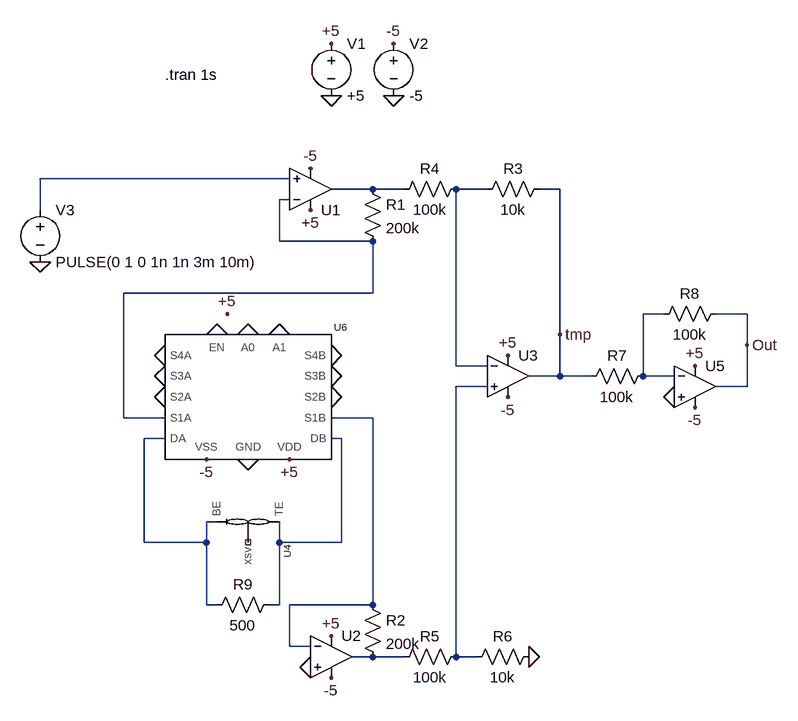
[diagram p0: schematic Draft3.asc]
Draft3.asc, the LTspice schematic file:
Version 4
SHEET 1 880 1028
WIRE 80 176 -304 176
WIRE 208 192 144 192
WIRE 256 192 208 192
WIRE 384 192 336 192
WIRE 496 192 464 192
WIRE 80 208 64 208
WIRE -304 224 -304 176
WIRE 64 272 64 208
WIRE 208 272 64 272
WIRE 208 352 208 272
WIRE 208 352 -176 352
WIRE 656 384 624 384
WIRE 784 384 736 384
WIRE 496 416 496 192
WIRE 784 432 784 384
WIRE 336 464 336 192
WIRE 384 464 336 464
WIRE 496 480 496 416
WIRE 496 480 448 480
WIRE 544 480 496 480
WIRE 624 480 624 384
WIRE 672 480 624 480
WIRE 384 496 336 496
WIRE 784 496 784 432
WIRE 784 496 736 496
WIRE -176 544 -176 352
WIRE -112 544 -176 544
WIRE 208 544 144 544
WIRE -112 576 -144 576
WIRE 160 576 144 576
WIRE -32 704 -48 704
WIRE -144 736 -144 576
WIRE -48 736 -48 704
WIRE -48 736 -144 736
WIRE 64 736 64 704
WIRE 160 736 160 576
WIRE 160 736 64 736
WIRE -48 832 -48 736
WIRE -32 832 -48 832
WIRE 64 832 64 736
WIRE 64 832 48 832
WIRE 208 832 208 544
WIRE 208 832 80 832
WIRE 80 896 80 832
WIRE 112 896 80 896
WIRE 208 912 176 912
WIRE 256 912 208 912
WIRE 336 912 336 496
WIRE 368 912 336 912
FLAG 144 48 0
FLAG 240 48 0
FLAG 144 -32 +5
FLAG 240 -32 -5
FLAG 112 224 +5
FLAG 144 880 +5
FLAG 416 448 +5
FLAG 416 512 -5
FLAG 144 944 -5
FLAG 112 160 -5
FLAG 448 912 0
FLAG 112 928 0
FLAG -304 304 0
FLAG 784 432 Out
FLAG 704 464 +5
FLAG 704 528 -5
FLAG 672 512 0
FLAG 496 416 tmp
FLAG -48 608 -5
FLAG 16 608 0
FLAG 80 608 +5
FLAG 16 416 0
FLAG 64 416 0
FLAG -32 416 0
FLAG -16 384 +5
FLAG -112 512 0
FLAG -112 480 0
FLAG -112 448 0
FLAG 144 448 0
FLAG 144 480 0
FLAG 144 512 0
SYMBOL Opamps\\UniversalOpamp2 112 192 M180
SYMATTR InstName U1
SYMBOL Opamps\\UniversalOpamp2 144 912 R0
SYMATTR InstName U2
SYMBOL Opamps\\UniversalOpamp2 416 480 R0
SYMATTR InstName U3
SYMBOL voltage 144 -48 R0
WINDOW 123 0 0 Left 0
WINDOW 39 24 124 Left 2
SYMATTR InstName V1
SYMATTR Value +5
SYMBOL voltage 240 -48 R0
WINDOW 123 0 0 Left 0
WINDOW 39 24 124 Left 2
SYMATTR InstName V2
SYMATTR Value -5
SYMBOL res 192 176 R0
SYMATTR InstName R1
SYMATTR Value 200k
SYMBOL res 192 816 R0
SYMATTR InstName R2
SYMATTR Value 200k
SYMBOL res 480 176 R90
WINDOW 0 0 56 VBottom 2
WINDOW 3 32 56 VTop 2
SYMATTR InstName R3
SYMATTR Value 10k
SYMBOL res 352 176 R90
WINDOW 0 0 56 VBottom 2
WINDOW 3 32 56 VTop 2
SYMATTR InstName R4
SYMATTR Value 100k
SYMBOL res 352 896 R90
WINDOW 0 0 56 VBottom 2
WINDOW 3 32 56 VTop 2
SYMATTR InstName R5
SYMATTR Value 100k
SYMBOL res 464 896 R90
WINDOW 0 0 56 VBottom 2
WINDOW 3 32 56 VTop 2
SYMATTR InstName R6
SYMATTR Value 10k
SYMBOL voltage -304 208 R0
WINDOW 123 0 0 Left 0
WINDOW 39 0 0 Left 0
SYMATTR InstName V3
SYMATTR Value PULSE(0 1 0 1n 1n 3m 10m)
SYMBOL Opamps\\UniversalOpamp2 704 496 R0
SYMATTR InstName U5
SYMBOL res 640 464 R90
WINDOW 0 0 56 VBottom 2
WINDOW 3 32 56 VTop 2
SYMATTR InstName R7
SYMATTR Value 100k
SYMBOL res 752 368 R90
WINDOW 0 0 56 VBottom 2
WINDOW 3 32 56 VTop 2
SYMATTR InstName R8
SYMATTR Value 100k
SYMBOL Memristive_brain\\ADG659 16 512 R0
SYMATTR InstName U6
SYMBOL Memristive_brain\\memristor_with_state 16 704 R90
SYMATTR SpiceModel MEM_KNOWM
SYMATTR InstName U4
SYMATTR Value Ron=10k Roff=10Meg Voff=1 Von=1 TAU=.1
SYMBOL res -48 848 R270
WINDOW 0 32 56 VTop 2
WINDOW 3 0 56 VBottom 2
SYMATTR InstName R9
SYMATTR Value 500
TEXT -112 16 Left 2 !.tran 1s

The netlist it stands for:
* Draft3.asc
XU1 N001 N004 +5 -5 N002 level.2 Avol=1Meg GBW=10Meg Slew=10Meg ilimit=25m rail=0 Vos=0 phimargin=45 en=0 enk=0 in=0 ink=0 Rin=500Meg  ; pins IN+ IN- V+ V- OUT
XU2 0 N007 +5 -5 N010 level.2 Avol=1Meg GBW=10Meg Slew=10Meg ilimit=25m rail=0 Vos=0 phimargin=45 en=0 enk=0 in=0 ink=0 Rin=500Meg  ; pins IN+ IN- V+ V- OUT
XU3 N006 N003 +5 -5 tmp level.2 Avol=1Meg GBW=10Meg Slew=10Meg ilimit=25m rail=0 Vos=0 phimargin=45 en=0 enk=0 in=0 ink=0 Rin=500Meg  ; pins IN+ IN- V+ V- OUT
V1 +5 0 +5
V2 -5 0 -5
R1 N002 N004 200k
R2 N007 N010 200k
R3 tmp N003 10k
R4 N003 N002 100k
R5 N006 N010 100k
R6 0 N006 10k
V3 N001 0 PULSE(0 1 0 1n 1n 3m 10m)
XU5 0 N005 +5 -5 Out level.2 Avol=1Meg GBW=10Meg Slew=10Meg ilimit=25m rail=0 Vos=0 phimargin=45 en=0 enk=0 in=0 ink=0 Rin=500Meg  ; pins IN+ IN- V+ V- OUT
R7 N005 tmp 100k
R8 Out N005 100k
XU6 N007 0 N009 0 0 0 -5 0 0 0 0 N004 N008 0 0 +5 ADG659  ; pins S1B S3B DB S4B S2B EN VSS GND A1 A0 S4A S1A DA S2A S3A VDD
XU4 N009 N008 NC_01 MEM_KNOWM Ron=10k Roff=10Meg Voff=1 Von=1 TAU=.1  ; pins TE BE xsv
R9 N008 N009 500
.tran 1s
.lib UniversalOpamps2.sub
.lib adg659.cir
.lib memristor_with_state.sub
.backanno
.end